# EAGLE schematic mainboard-gsm (EAGLE 6.2)
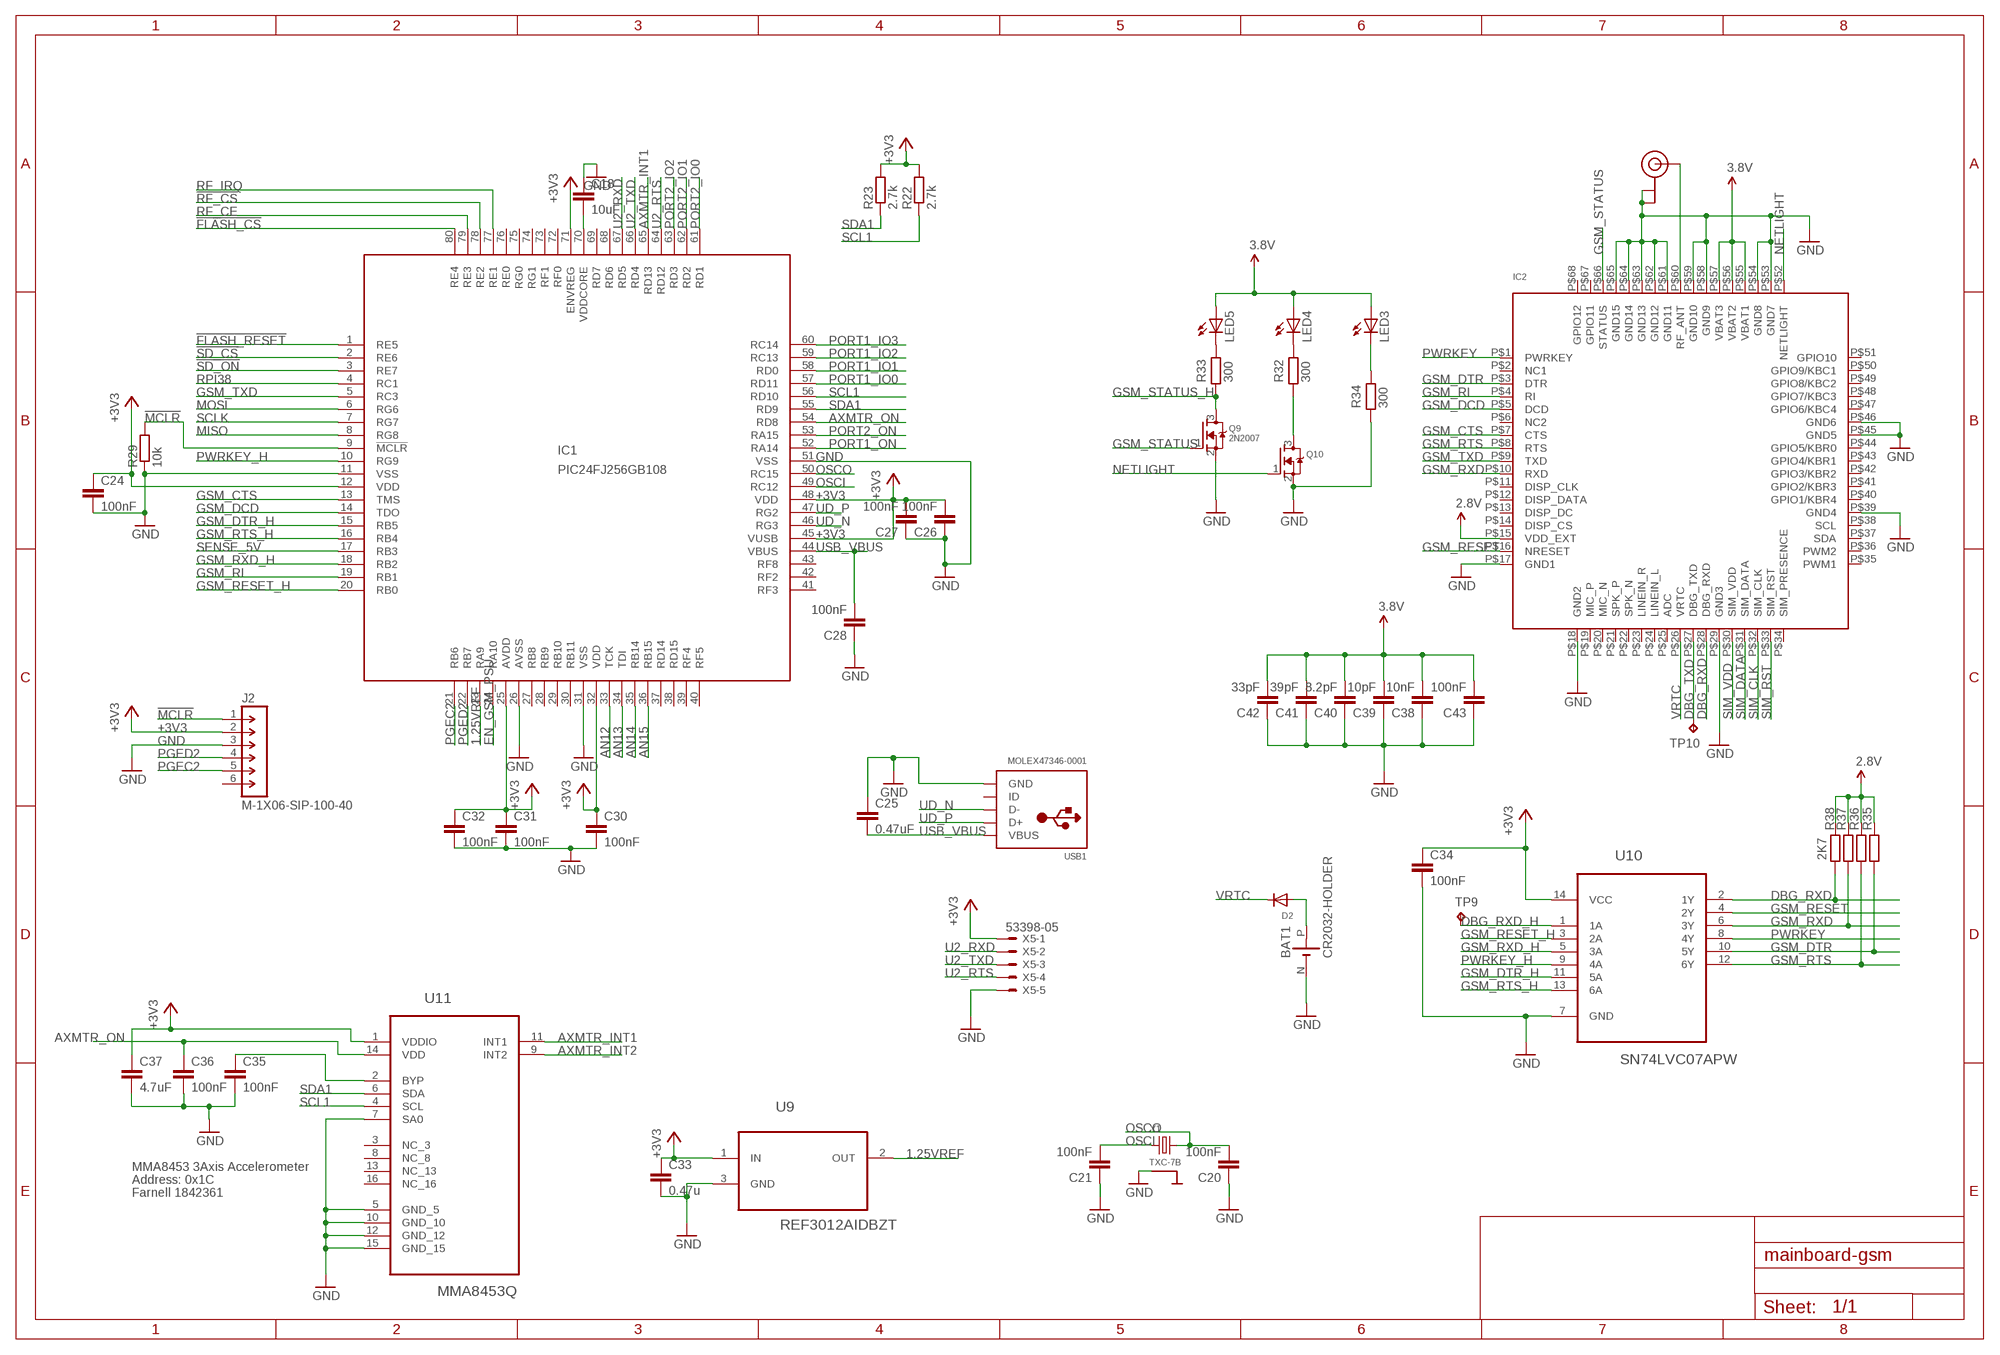
[diagram p0: schematic, sheet 1, part 1 of 3]
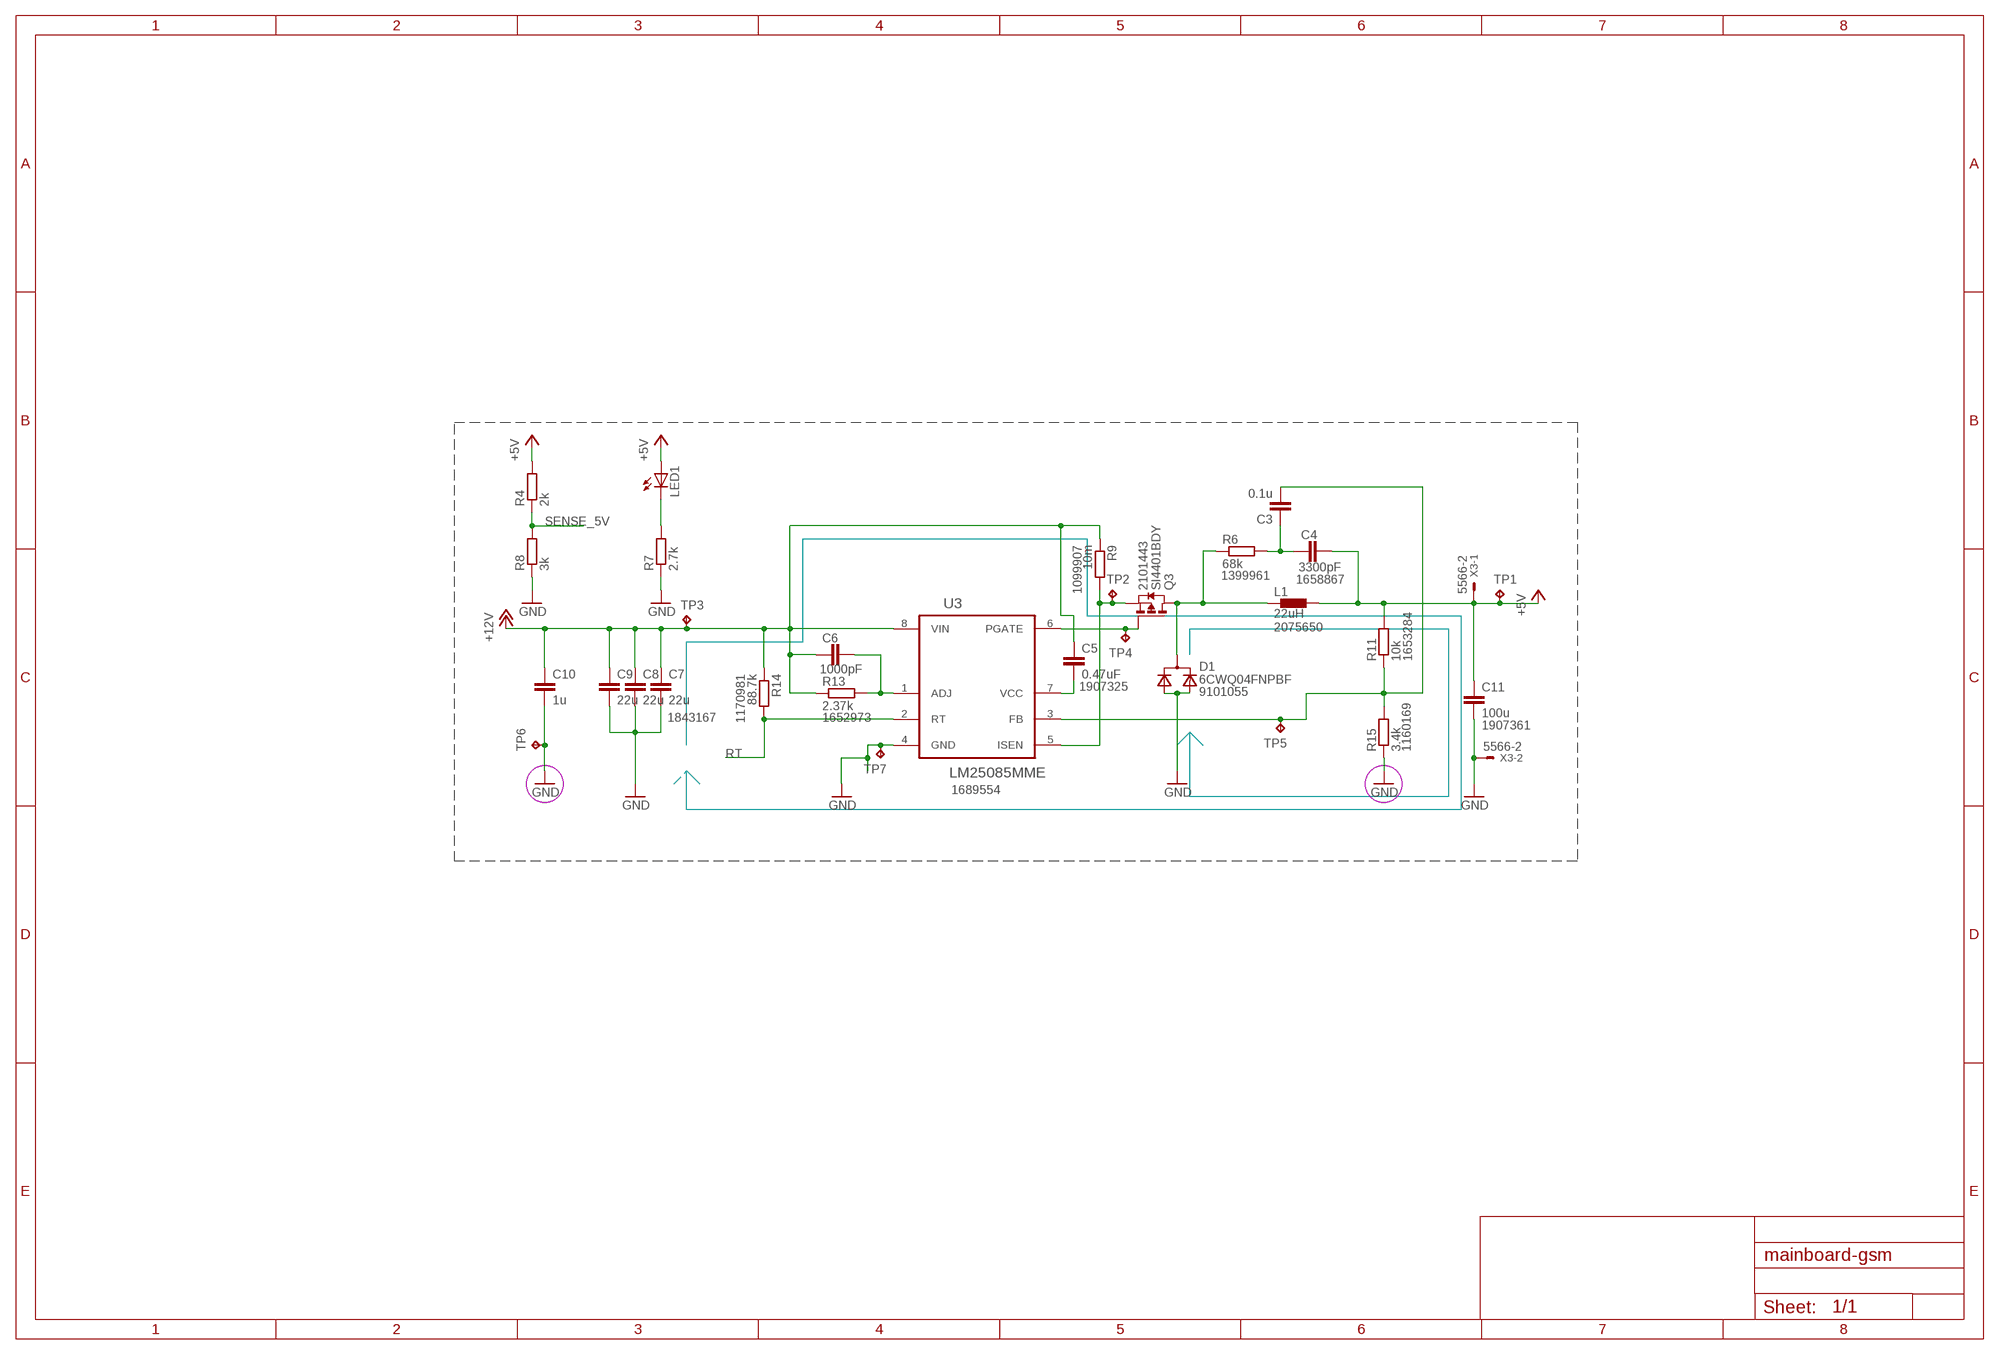
[diagram p1: schematic, sheet 1, part 2 of 3]
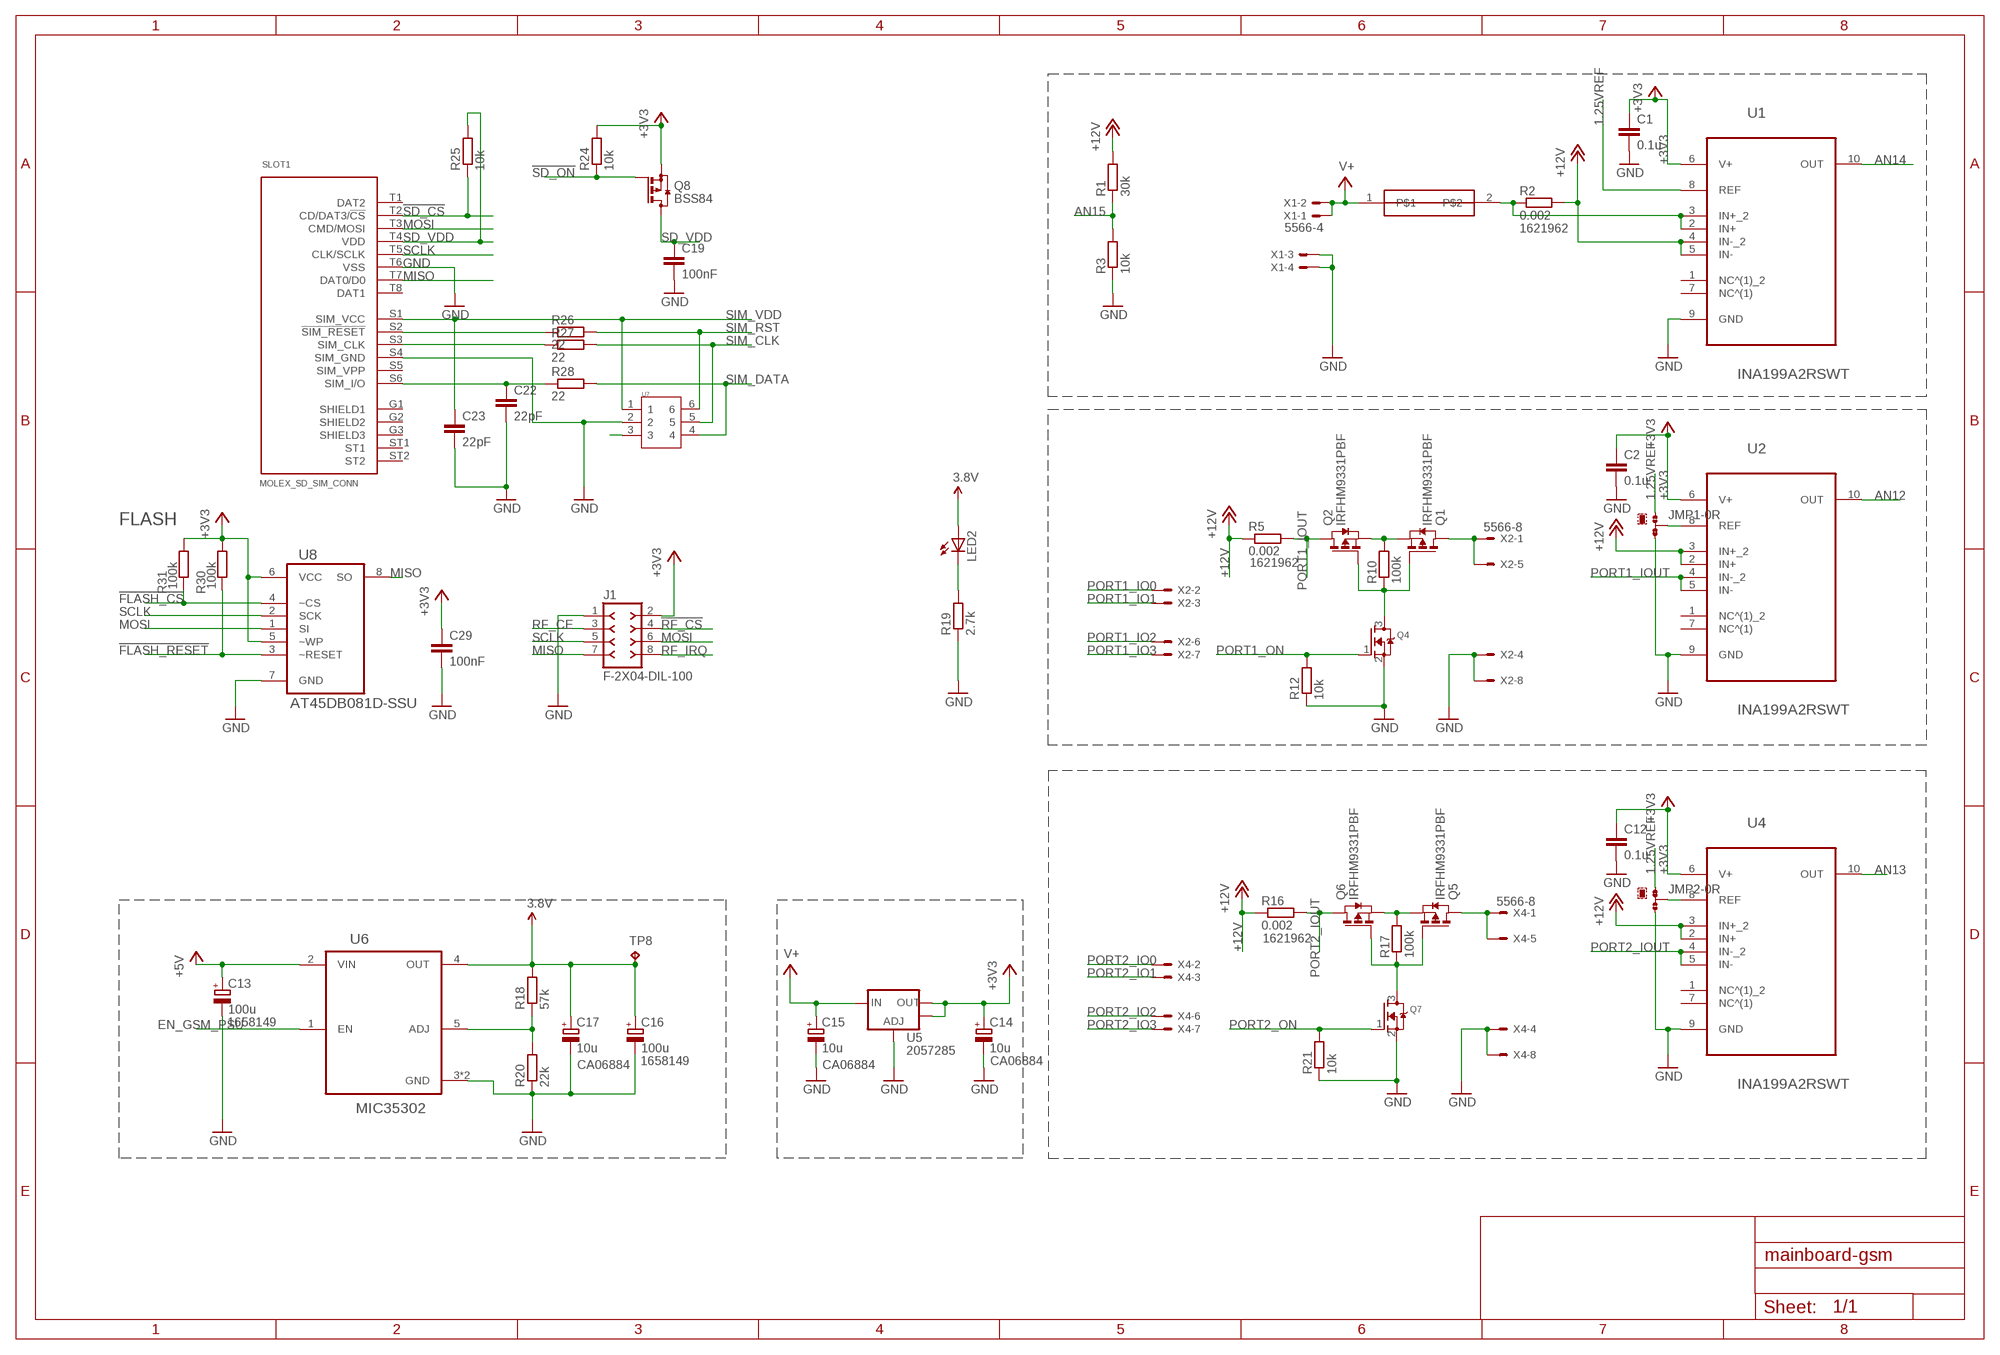
[diagram p2: schematic, sheet 1, part 3 of 3]

## Parts
ANT1  U.FL  [U.FL]
BAT1  CR2032-HOLDER  [CH28-2032L]
C1  0.1u  C-EUC0603  [C0603]
C2  0.1u  C-EUC0603  [C0603]
C3  0.1u  C-EUC0603  [C0603]
C4  3300pF  C-EUC0603  [C0603]
C5  0.47uF  C-EUC0805  [C0805]
C6  1000pF  C-EUC0603  [C0603]
C7  22u  C-EUC1812  [C1812]
C8  22u  C-EUC1812  [C1812]
C9  22u  C-EUC1812  [C1812]
C10  1u  C-EUC0805  [C0805]
C11  100u  C-EUC1210  [C1210]
C12  0.1u  C-EUC0603  [C0603]
C13  100u  CPOL-EUB/3528-21R  [B/3528-21R]
C14  10u  CPOL-EUD/7343-31R  [D/7343-31R]
C15  10u  CPOL-EUD/7343-31R  [D/7343-31R]
C16  100u  CPOL-EUB/3528-21R  [B/3528-21R]
C17  10u  CPOL-EUD/7343-31R  [D/7343-31R]
C18  10uF  C-EUC0805  [C0805]
C19  100nF  C-EUC0603  [C0603]
C20  100nF  C-EUC0603  [C0603]
C21  100nF  C-EUC0603  [C0603]
C22  22pF  C-EUC0603  [C0603]
C23  22pF  C-EUC0603  [C0603]
C24  100nF  C-EUC0603  [C0603]
C25  0.47uF  C-EUC1206  [C1206]
C26  100nF  C-EUC0603  [C0603]
C27  100nF  C-EUC0603  [C0603]
C28  100nF  C-EUC0603  [C0603]
C29  100nF  C-EUC0603  [C0603]
C30  100nF  C-EUC0603  [C0603]
C31  100nF  C-EUC0603  [C0603]
C32  100nF  C-EUC0603  [C0603]
C33  0.47u  C-EUC0805  [C0805]
C34  100nF  C-EUC0603  [C0603]
C35  100nF  C-EUC0603  [C0603]
C36  100nF  C-EUC0603  [C0603]
C37  4.7uF  C-EUC0805  [C0805]
C38  10nF  C-EUC0603  [C0603]
C39  10pF  C-EUC0603  [C0603]
C40  8.2pF  C-EUC0603  [C0603]
C41  39pF  C-EUC0603  [C0603]
C42  33pF  C-EUC0603  [C0603]
C43  100nF  C-EUC0603  [C0603]
CONN1  MINIBLADE_SOCKET  [LTF153008]
D1  6CWQ04FNPBF  [TO252-AA]
D2  DIODESOD-123  [SOD-123]
IC1  PIC24FJ256GB108  [TQFP80-12X12]
IC2  SIM900_LITERAL  [SIM900_SMT]
J1  F-2X04-DIL-100  [DIL-100-2X04]
J2  M-1X06-SIP-100-40  [SIP-100-06-40]
JMP1  0R-JUMPA  [A0R-JMP]
JMP2  0R-JUMPA  [A0R-JMP]
L1  22uH  HC9-XXX-R  [HC9-XXX-R]
LED1  LEDCHIPLED_0805  [CHIPLED_0805]
LED2  LEDCHIPLED_0805  [CHIPLED_0805]
LED3  LEDCHIPLED_0805  [CHIPLED_0805]
LED4  LEDCHIPLED_0805  [CHIPLED_0805]
LED5  LEDCHIPLED_0805  [CHIPLED_0805]
Q1  IRFHM9331PBF  [IR_PQFN_FET]
Q2  IRFHM9331PBF  [IR_PQFN_FET]
Q3  SI4401BDY  [SO8-FET]
Q4  MOSFET-NREFLOW  [SOT23]
Q5  IRFHM9331PBF  [IR_PQFN_FET]
Q6  IRFHM9331PBF  [IR_PQFN_FET]
Q7  MOSFET-NREFLOW  [SOT23]
Q8  BSS84  [SOT23]
Q9  2N2007  MOSFET-NREFLOW  [SOT23]
Q10  MOSFET-NREFLOW  [SOT23]
R1  30k  R-EU_R0805  [R0805]
R2  0.002  R-EU_R1206  [R1206]
R3  10k  R-EU_R0805  [R0805]
R4  2k  R-EU_R0805  [R0805]
R5  0.002  R-EU_R1206  [R1206]
R6  68k  R-EU_R0603  [R0603]
R7  2.7k  R-EU_R0805  [R0805]
R8  3k  R-EU_R0805  [R0805]
R9  10m  R-EU_R1206  [R1206]
R10  100k  R-EU_R0603  [R0603]
R11  10k  R-EU_R0805  [R0805]
R12  10k  R-EU_R0603  [R0603]
R13  2.37k  R-EU_R0805  [R0805]
R14  88.7k  R-EU_R0603  [R0603]
R15  3.4k  R-EU_R0805  [R0805]
R16  0.002  R-EU_R1206  [R1206]
R17  100k  R-EU_R0603  [R0603]
R18  57k  R-EU_R0603  [R0603]
R19  2.7k  R-EU_R0805  [R0805]
R20  22k  R-EU_R0603  [R0603]
R21  10k  R-EU_R0603  [R0603]
R22  2.7k  R-EU_R0603  [R0603]
R23  2.7k  R-EU_R0603  [R0603]
R24  10k  R-EU_R0603  [R0603]
R25  10k  R-EU_R0603  [R0603]
R26  22  R-EU_R0603  [R0603]
R27  22  R-EU_R0603  [R0603]
R28  22  R-EU_R0603  [R0603]
R29  10k  R-EU_R0603  [R0603]
R30  100k  R-EU_R0603  [R0603]
R31  100k  R-EU_R0603  [R0603]
R32  300  R-EU_R0603  [R0603]
R33  300  R-EU_R0603  [R0603]
R34  300  R-EU_R0603  [R0603]
R35  2K7  R-EU_R0603  [R0603]
R36  2K7  R-EU_R0603  [R0603]
R37  2K7  R-EU_R0603  [R0603]
R38  2K7  R-EU_R0603  [R0603]
SLOT1  MOLEX_SD_SIM_CONN  [MOLEX_SDSIM_COMBO]
TP1  TPTP09R  [TP09R]
TP2  TPTP10R  [TP10R]
TP3  TPTP10R  [TP10R]
TP4  TPTP10R  [TP10R]
TP5  TPTP10R  [TP10R]
TP6  TPTP10R  [TP10R]
TP7  TPTP10R  [TP10R]
TP8  TPTP09R  [TP09R]
TP9  TPTP10R  [TP10R]
TP10  TPTP10R  [TP10R]
U1  INA199A2RSWT  [QFN40P140X180X55-10N]
U2  INA199A2RSWT  [QFN40P140X180X55-10N]
U3  LM25085MME  [MINI-SO8]
U4  INA199A2RSWT  [QFN40P140X180X55-10N]
U5  V_REG_LM1117SOT223  [SOT223]
U6  MIC35302  [TO252-5]
U7  SMF05C'-SC70'  [SC70-6L]
U8  AT45DB081D-SSU  [SOIC127P600X175-8N]
U9  REF3012AIDBZT  [SOT95P237X112-3N]
U10  SN74LVC07APW  [SOP65P640X120-14N]
U11  MMA8453Q  [QFN50P300X300X100-16N]
USB1  MOLEX47346-0001  [47346-0001]
X1  5566-4  [5566-4]
X2  5566-8  [5566-8]
X3  5566-2  [5566-2]
X4  5566-8  [5566-8]
X5  53398-05  [53398-05]
Y1  TXC-7B  [TXC-7B]

## Nets
1.25VREF: IC1.23(RA9) JMP1.1 JMP2.1 U1.8(REF) U9.2(OUT)
2.8V: IC2.P$15(VDD_EXT) R35.2 R36.2 R37.2 R38.2
3.8V: C16.+ C17.+ C38.2 C39.2 C40.2 C41.2 C42.2 C43.2 IC2.P$55(VBAT1) IC2.P$56(VBAT2) IC2.P$57(VBAT3) LED2.A LED3.A LED4.A LED5.A R18.2 TP8.TP U6.4(OUT)
!FLASH_CS!: IC1.80(RE4) R31.2 U8.4(~CS)
!FLASH_RESET!: IC1.1(RE5) R30.2 U8.3(~RESET)
!MCLR!: IC1.9(!MCLR) J2.1 R29.2
!RF_CS!: IC1.78(RE2) J1.4
!SD_CS!: IC1.2(RE6) R25.1 SLOT1.T2(CD/DAT3/!CS!)
!SD_ON!: IC1.3(RE7) Q8.1(G) R24.1
+3V3: C1.1 C2.1 C12.1 C14.+ C24.1 C26.2 C27.2 C29.1 C30.1 C31.1 C32.1 C33.1 C34.1 C37.1 IC1.12(VDD) IC1.25(AVDD) IC1.32(VDD) IC1.45(VUSB) IC1.48(VDD) IC1.71(ENVREG) J1.2 J2.2 Q8.2(S) R22.2 R23.2 R24.2 R30.1 R31.1 U1.6(V+) U2.6(V+) U4.6(V+) U5.2(OUT) U5.4(OUT) U8.5(~WP) U8.6(VCC) U9.1(IN) U10.14(VCC) U11.1(VDDIO) X5.1
+5V: C4.1 C11.1 C13.+ L1.2 LED1.A R4.2 R11.2 TP1.TP U6.2(VIN) X3.1
+12V: C5.1 C6.1 C7.1 C8.1 C9.1 C10.1 R1.2 R2.2 R5.1 R9.1 R13.1 R14.1 R16.1 TP3.TP U1.4(IN-_2) U1.5(IN-) U2.2(IN+) U2.3(IN+_2) U3.8(VIN) U4.2(IN+) U4.3(IN+_2)
AN12: IC1.33(TCK) U2.10(OUT)
AN13: IC1.34(TDI) U4.10(OUT)
AN14: IC1.35(RB14) U1.10(OUT)
AN15: IC1.36(RB15) R1.1 R3.2
AXMTR_INT1: IC1.65(RD13) U11.11(INT1)
AXMTR_INT2: U11.9(INT2)
AXMTR_ON: C36.1 IC1.54(RD8) U11.14(VDD)
DBG_RXD: IC2.P$28(DBG_RXD) R38.1 U10.2(1Y)
DBG_RXD_H: TP9.TP U10.1(1A)
DBG_TXD: IC2.P$27(DBG_TXD) TP10.TP
EN_GSM_PSU: IC1.24(RA10) U6.1(EN)
GND: ANT1.P$1(GND) ANT1.P$2(GND) BAT1.N(-) C1.2 C2.2 C7.2 C8.2 C9.2 C10.2 C11.2 C12.2 C13.- C14.- C15.- C16.- C17.- C18.1 C19.2 C20.1 C21.1 C22.2 C23.2 C24.2 C25.1 C26.1 C27.1 C28.1 C29.2 C30.2 C31.2 C32.2 C33.2 C34.2 C35.2 C36.2 C37.2 C38.1 C39.1 C40.1 C41.1 C42.1 C43.1 D1.1(A1) D1.3(A2) IC1.11(VSS) IC1.26(AVSS) IC1.31(VSS) IC1.51(VSS) IC2.P$17(GND1) IC2.P$18(GND2) IC2.P$29(GND3) IC2.P$39(GND4) IC2.P$45(GND5) IC2.P$46(GND6) IC2.P$53(GND7) IC2.P$54(GND8) IC2.P$58(GND9) IC2.P$59(GND10) IC2.P$61(GND11) IC2.P$62(GND12) IC2.P$63(GND13) IC2.P$64(GND14) IC2.P$65(GND15) J1.1 J2.3 JMP1.3 JMP2.3 Q4.2(S) Q7.2(S) Q9.2(S) Q10.2(S) R3.1 R7.1 R8.1 R12.1 R15.1 R19.1 R20.1 R21.1 R29.1 R34.1 SLOT1.S4(SIM_GND) SLOT1.T6(VSS) TP6.TP TP7.TP U1.9(GND) U2.9(GND) U3.4(GND) U4.9(GND) U5.1(ADJ) U6.3(GND) U6.TAB(GND) U7.2 U8.7(GND) U9.3(GND) U10.7(GND) U11.5(GND_5) U11.7(SA0) U11.10(GND_10) U11.12(GND_12) U11.15(GND_15) USB1.5(GND) X1.3 X1.4 X2.4 X2.8 X3.2 X4.4 X4.8 X5.5 Y1.2 Y1.4
GSM_CTS: IC1.13(TMS) IC2.P$7(CTS)
GSM_DCD: IC1.14(TDO) IC2.P$5(DCD)
GSM_DTR: IC2.P$3(DTR) R35.1 U10.10(5Y)
GSM_DTR_H: IC1.15(RB5) U10.11(5A)
GSM_RESET: IC2.P$16(NRESET) U10.4(2Y)
GSM_RESET_H: IC1.20(RB0) U10.3(2A)
GSM_RI: IC1.19(RB1) IC2.P$4(RI)
GSM_RTS: IC2.P$8(RTS) R36.1 U10.12(6Y)
GSM_RTS_H: IC1.16(RB4) U10.13(6A)
GSM_RXD: IC2.P$10(RXD) R37.1 U10.6(3Y)
GSM_RXD_H: IC1.18(RB2) U10.5(3A)
GSM_STATUS: IC2.P$66(STATUS) Q9.1(G)
GSM_STATUS_H: Q9.3(D) R33.1
GSM_TXD: IC1.5(RC3) IC2.P$9(TXD)
MISO: IC1.8(RG8) J1.7 SLOT1.T7(DAT0/D0) U8.8(SO)
MOSI: IC1.6(RG6) J1.6 SLOT1.T3(CMD/MOSI) U8.1(SI)
N$1: C35.1 U11.2(BYP)
N$2: R26.1 SLOT1.S2(!SIM_RESET!)
N$3: R27.1 SLOT1.S3(SIM_CLK)
N$4: C22.1 R28.1 SLOT1.S6(SIM_I/O)
N$5: ANT1.P$3(SIGNAL) IC2.P$60(RF_ANT)
N$6: Q10.3(D) R32.1
N$7: LED5.C R33.2
N$8: LED4.C R32.2
N$9: BAT1.P(+) D2.A
N$10: Q3.4(G) TP4.TP U3.6(PGATE)
N$11: D1.4(C) L1.1 Q3.5(D) Q3.6(D) Q3.7(D) Q3.8(D) Q3.D1(D) Q3.D2(D) Q3.D3(D) R6.1
N$12: Q5.1(S) Q5.2(S) Q5.3(S) Q5.3B(S) Q6.1(S) Q6.2(S) Q6.3(S) Q6.3B(S) R17.2
N$13: C5.2 U3.7(VCC)
N$14: Q3.1(S) Q3.2(S) Q3.3(S) R9.2 TP2.TP U3.5(ISEN)
N$15: Q5.4(G) Q6.4(G) Q7.3(D) R17.1
N$16: C6.2 R13.2 U3.1(ADJ)
N$17: JMP1.2 U2.8(REF)
N$18: Q5.5(D) Q5.6(D) Q5.7(D) Q5.8(D) Q5.9(D) X4.1 X4.5
N$19: Q1.1(S) Q1.2(S) Q1.3(S) Q1.3B(S) Q2.1(S) Q2.2(S) Q2.3(S) Q2.3B(S) R10.2
N$20: Q1.4(G) Q2.4(G) Q4.3(D) R10.1
N$21: C3.1 C4.2 R6.2
N$22: C3.2 R11.1 R15.2 TP5.TP U3.3(FB)
N$23: LED3.C R34.2
N$24: Q1.5(D) Q1.6(D) Q1.7(D) Q1.8(D) Q1.9(D) X2.1 X2.5
N$25: R18.1 R20.2 U6.5(ADJ)
N$26: CONN1.2 R2.1 U1.2(IN+) U1.3(IN+_2)
N$27: JMP2.2 U4.8(REF)
N$29: U7.3
N$31: LED1.C R7.2
N$32: LED2.C R19.2
N$38: C18.2 IC1.70(VDDCORE)
NETLIGHT: IC2.P$52(NETLIGHT) Q10.1(G)
OSCI: C21.2 IC1.49(RC12) Y1.1
OSCO: C20.2 IC1.50(RC15) Y1.3
PGEC2: IC1.21(RB6) J2.5
PGED2: IC1.22(RB7) J2.4
PORT1_IO0: IC1.57(RD11) X2.2
PORT1_IO1: IC1.58(RD0) X2.3
PORT1_IO2: IC1.59(RC13) X2.6
PORT1_IO3: IC1.60(RC14) X2.7
PORT1_IOUT: Q2.5(D) Q2.6(D) Q2.7(D) Q2.8(D) Q2.9(D) R5.2 U2.4(IN-_2) U2.5(IN-)
PORT1_ON: IC1.52(RA14) Q4.1(G) R12.2
PORT2_IO0: IC1.61(RD1) X4.2
PORT2_IO1: IC1.62(RD2) X4.3
PORT2_IO2: IC1.63(RD3) X4.6
PORT2_IO3: X4.7
PORT2_IOUT: Q6.5(D) Q6.6(D) Q6.7(D) Q6.8(D) Q6.9(D) R16.2 U4.4(IN-_2) U4.5(IN-)
PORT2_ON: IC1.53(RA15) Q7.1(G) R21.2
PWRKEY: IC2.P$1(PWRKEY) U10.8(4Y)
PWRKEY_H: IC1.10(RG9) U10.9(4A)
RF_CE: IC1.79(RE3) J1.3
RF_IRQ: IC1.77(RE1) J1.8
RPI38: IC1.4(RC1)
RT: R14.2 U3.2(RT)
SCL1: IC1.56(RD10) R22.1 U11.4(SCL)
SCLK: IC1.7(RG7) J1.5 SLOT1.T5(CLK/SCLK) U8.2(SCK)
SD_VDD: C19.1 Q8.3(D) R25.2 SLOT1.T4(VDD)
SDA1: IC1.55(RD9) R23.1 U11.6(SDA)
SENSE_5V: IC1.17(RB3) R4.1 R8.2
SIM_CLK: IC2.P$32(SIM_CLK) R27.2 U7.5
SIM_DATA: IC2.P$31(SIM_DATA) R28.2 U7.4
SIM_RST: IC2.P$33(SIM_RST) R26.2 U7.6
SIM_VDD: C23.1 IC2.P$30(SIM_VDD) SLOT1.S1(SIM_VCC) U7.1
U2_RTS: IC1.64(RD12) X5.4
U2_RXD: IC1.67(RD5) X5.2
U2_TXD: IC1.66(RD4) X5.3
UD_N: IC1.46(RG3) USB1.2(D-)
UD_P: IC1.47(RG2) USB1.3(D+)
USB_VBUS: C25.2 C28.2 IC1.44(VBUS) USB1.1(VBUS)
V+: C15.+ CONN1.1 U5.3(IN) X1.1 X1.2
VRTC: D2.C IC2.P$26(VRTC)
Unconnected: IC1.27(RB8) IC1.28(RB9) IC1.29(RB10) IC1.30(RB11) IC1.37(RD14) IC1.38(RD15) IC1.39(RF4) IC1.40(RF5) IC1.41(RF3) IC1.42(RF2) IC1.43(RF8) IC1.68(RD6) IC1.69(RD7) IC1.72(RF0) IC1.73(RF1) IC1.74(RG1) IC1.75(RG0) IC1.76(RE0) IC2.P$2(NC1) IC2.P$6(NC2) IC2.P$11(DISP_CLK) IC2.P$12(DISP_DATA) IC2.P$13(DISP_DC) IC2.P$14(DISP_CS) IC2.P$19(MIC_P) IC2.P$20(MIC_N) IC2.P$21(SPK_P) IC2.P$22(SPK_N) IC2.P$23(LINEIN_R) IC2.P$24(LINEIN_L) IC2.P$25(ADC) IC2.P$34(SIM_PRESENCE) IC2.P$35(PWM1) IC2.P$36(PWM2) IC2.P$37(SDA) IC2.P$38(SCL) IC2.P$40(GPIO1/KBR4) IC2.P$41(GPIO2/KBR3) IC2.P$42(GPIO3/KBR2) IC2.P$43(GPIO4/KBR1) IC2.P$44(GPIO5/KBR0) IC2.P$47(GPIO6/KBC4) IC2.P$48(GPIO7/KBC3) IC2.P$49(GPIO8/KBC2) IC2.P$50(GPIO9/KBC1) IC2.P$51(GPIO10) J2.6 SLOT1.G1(SHIELD1) SLOT1.G2(SHIELD2) SLOT1.G3(SHIELD3) SLOT1.S5(SIM_VPP) SLOT1.ST1 SLOT1.ST2 SLOT1.T1(DAT2) SLOT1.T8(DAT1) U1.1(NC^(1)_2) U1.7(NC^(1)) U2.1(NC^(1)_2) U2.7(NC^(1)) U4.1(NC^(1)_2) U4.7(NC^(1)) U11.3(NC_3) U11.8(NC_8) U11.13(NC_13) U11.16(NC_16) USB1.4(ID)

## Notes on the sheet
- FLASH
- MMA8453 3Axis Accelerometer
- Address: 0x1C
- Farnell 1842361

## Power pins joined to a net without a drawn wire
GPIO11: IC2.P$67(GPIO11)
GPIO12: IC2.P$68(GPIO12)

## Library data of the parts
ANT1 = SparkFun-Connectors:U.FL: SMD antenna connector- WRL-09144
BAT1 = probox-parts:CR2032-HOLDER: http://onecall.farnell.com/multicomp/ch28-2032lf/battery-holder-smt-20mm/dp/2064725?ref=lookahead
C1-C3 C6 C8-C10 C12 C18-C43 = resistor:C-EU: CAPACITOR, European symbol
C4 = resistor:C-EU: CAPACITOR, European symbol; FARNELL: 1658867
C5 = resistor:C-EU: CAPACITOR, European symbol; FARNELL: 1907325
C7 = resistor:C-EU: CAPACITOR, European symbol; FARNELL: 1843167
C11 = resistor:C-EU: CAPACITOR, European symbol; FARNELL: 1907361
C13 C16 = resistor:CPOL-EU: POLARIZED CAPACITOR, European symbol; FARNELL: 1658149
C14 C15 C17 = resistor:CPOL-EU: POLARIZED CAPACITOR, European symbol; FARNELL: CA06884
CONN1 = eko-parts:MINIBLADE_SOCKET
D1 = probox-parts:6CWQ04FNPBF; FARNELL: 9101055
D2 = adafruit:DIODE: Diode SMADIODE - SMA Surface Mount Package 20V 1A Schottky Diode Digikey: 641-1014-6-ND DO-1N4148 - Through Hole Small Current Diode SOD-123 20V 1 A (.5mV Vf) Schottky Diode - Digikey: MBRX120TPMSCT-ND SOD-323 10V 570mA (.38mV Vf, 3ns) Schottky Diode - Digikey: ZLLS410CT-ND SOD-523 30V 30mA Schottky Diode (RB751S-40TE61) - Digikey: RB751S-40TE61CT-ND SOT23-R/W - SOT23 Package (R = Solder Paste/Reflow Ovens, W = Hand-Soldering) BAT54Film 40V 300mA - Digikey: 497-7162-1-ND
IC1 = microchip:PIC24FJ256GB108: PIC24FJ256GB108 edit this description Auto generated by make-symbol-device-package-bsdl.ulp Rev. 25 Source: PIC24FJ256GB108.bsd; MPN: PIC24FJ256GB108-I/PT; OC_FARNELL: 1576869; OC_NEWARK: 54M5131
IC2 = microbuilder:SIM900_LITERAL: SIM900 Quad-Band GSM/GPRS Module Power Supply: 3.2-4.8V Temperature Range: -30°C-+80°C Bands: GSM 850, EGSM 900, DCS 1800, PCS 1900
J1 = con-headers-jp:F-2X04-: FEMALE HEADER
J2 = con-headers-jp:M-1X06-: MALE HEADER
JMP1 JMP2 = jump-0r-smd:0R-JUMP: SMD 0R 0805 Jumper
L1 = probox-parts:HC9-XXX-R; FARNELL: 2075650
LED1-LED5 = led:LED: LED OSRAM: - CHIPLED LG R971, LG N971, LY N971, LG Q971, LY Q971, LO R971, LY R971 LH N974, LH R974 LS Q976, LO Q976, LY Q976 LO Q996 - Hyper CHIPLED LW Q18S LB Q993, LB Q99A, LB R99A - SideLED LS A670, LO A670, LY A670, LG A670, LP A670 LB A673, LV A673, LT A673, LW A673 LH A674 LY A675 LS A676, LA A676, LO A676, LY A676, LW A676 LS A679, LY A679, LG A679 - Hyper Micro SIDELED® LS Y876, LA Y876, LO Y876, LY Y876 LT Y87S - SmartLED LW L88C, LW L88S LB L89C, LB L89S, LG L890 LS L89K, LO L89K, LY L89K LS L896, LA L896, LO L896, LY L896 - TOPLED LS T670, LO T670, LY T670, LG T670, LP T670 LSG T670, LSP T670, LSY T670, LOP T670, LYG T670 LG T671, LOG T671, LSG T671 LB T673, LV T673, LT T673, LW T673 LH T674 LS T676, LA T676, LO T676, LY T676, LB T676, LH T676, LSB T676, LW T676 LB T67C, LV T67C, LT T67C, LS T67K, LO T67K, LY T67K, LW E67C LS E67B, LA E67B, LO E67B, LY E67B, LB E67C, LV E67C, LT E67C LW T67C LS T679, LY T679, LG T679 LS T770, LO T770, LY T770, LG T770, LP T770 LB T773, LV T773, LT T773, LW T773 LH T774 LS E675, LA E675, LY E675, LS T675 LS T776, LA T776, LO T776, LY T776, LB T776 LHGB T686 LT T68C, LB T68C - Hyper Mini TOPLED® LB M676 - Mini TOPLED Santana® LG M470 LS M47K, LO M47K, LY M47K Source: http://www.osram.convergy.de LUXEON: - LUMILED® LXK2-PW12-R00, LXK2-PW12-S00, LXK2-PW14-U00, LXK2-PW14-V00 LXK2-PM12-R00, LXK2-PM12-S00, LXK2-PM14-U00 LXK2-PE12-Q00, LXK2-PE12-R00, LXK2-PE12-S00, LXK2-PE14-T00, LXK2-PE14-U00 LXK2-PB12-K00, LXK2-PB12-L00, LXK2-PB12-M00, LXK2-PB14-N00, LXK2-PB14-P00, LXK2-PB14-Q00 LXK2-PR12-L00, LXK2-PR12-M00, LXK2-PR14-Q00, LXK2-PR14-R00 LXK2-PD12-Q00, LXK2-PD12-R00, LXK2-PD12-S00 LXK2-PH12-R00, LXK2-PH12-S00 LXK2-PL12-P00, LXK2-PL12-Q00, LXK2-PL12-R00 Source: www.luxeon.com KINGBRIGHT: KA-3528ASYC Source: www.kingbright.com
Q1 Q2 Q5 Q6 = probox-parts:IRFHM9331PBF
Q3 = probox-parts:SI4401BDY; FARNELL: 2101443
Q4 Q7 Q9 Q10 = adafruit:MOSFET-N: N-Channel Mosfet 2N7002E - 60V 260mA SOT23 [Digikey: 2N7002ET1GOSTR-ND] - REEL BSH103 - 30V 850mA SOT23 [Digikey: 568-5013-1-ND]
Q8 = transistor-small-signal:BSS84: P-CHANNEL MOS FET; FARNELL: 1972673
R1 R3 R4 R7 R8 R10 R12 R17-R38 = resistor:R-EU_: RESISTOR, European symbol
R2 R5 R16 = resistor:R-EU_: RESISTOR, European symbol; FARNELL: 1621962
R6 = resistor:R-EU_: RESISTOR, European symbol; FARNELL: 1399961
R9 = resistor:R-EU_: RESISTOR, European symbol; FARNELL: 1099907
R11 = resistor:R-EU_: RESISTOR, European symbol; FARNELL: 1653284
R13 = resistor:R-EU_: RESISTOR, European symbol; FARNELL: 1652973
R14 = resistor:R-EU_: RESISTOR, European symbol; FARNELL: 1170981
R15 = resistor:R-EU_: RESISTOR, European symbol; FARNELL: 1160169
SLOT1 = farnellparts:MOLEX_SD_SIM_CONN; FARNELL: 2064064; MOLEX: 49448-1411
TP1-TP10 = testpad:TP: Test pad
U1 U2 U4 = probox-parts:INA199A2RSWT: Voltage Output, High or Low Side Measurement, Bi-Directional Zerø-Drift Series CURRENT SHUNT MONITOR; MPN: INA199A2RSWT; OC_FARNELL: 1815789; OC_NEWARK: 74R0562; PACKAGE: UQFN-10; SUPPLIER: Texas Instrument
U3 = probox-parts:LM25085; FARNELL: 1689554
U5 = SparkFun-PowerIC:V_REG_LM1117: Voltage Regulator LM1117 Standard adjustable voltage regulator but in SMD form. Spark Fun Electronics SKU : COM-00595; FARNELL: 2057285
U6 = probox-parts:MIC35302; FARNELL: 1822373
U7 = IC:SMF05C: http://www.semtech.com/images/datasheet/smf05c.pdf
U8 = farnellparts:AT45DB081D-SSU; DESCRIPTION: Data Flash; MPN: AT45DB081D-SSU; OC_FARNELL: 1455038; OC_NEWARK: 58M3836; PACKAGE: SOIC-8; SUPPLIER: Atmel
U9 = probox-parts:REF3012AIDBZT: CMOS VOLTAGE REFERENCE; MPN: REF3120AIDBZT; OC_FARNELL: 1470321; OC_NEWARK: 90H3371; PACKAGE: SOT-23-3; SUPPLIER: Texas Instruments
U10 = farnellparts:SN74LVC07APW; DESCRIPTION: QUADRUPLE FET BUS SWITCH 2.5-V/3.3-V LOW-VOLTAGE BUS SWITCH WITH 5-V-TOLERANT LEVEL SHIFTER; MPN: SN74LVC07APW; OC_FARNELL: 1236302; OC_NEWARK: 13M5252; PACKAGE: TSSOP-14; SUPPLIER: Texas Instruments
U11 = farnellparts:MMA8453Q
USB1 = connectors-bbng:MOLEX47346-0001: USB Micro B http://onecall.farnell.com/jsp/search/browse.jsp;jsessionid=IUXOLF3HYHDEGCQLCIPJOXQ?N=411&Ntk=gensearch&Ntt=47346-0001&Ntx=mode+matchallpartial&exposeLevel2Refinement=true&suggestions=false&ref=globalsearch&_requestid=528981
X1 = con-molex:5566-4: Mini FIT connector 4 pol Source: http://www.molex.com; OC_FARNELL: unknown; OC_NEWARK: unknown
X2 X4 = con-molex:5566-8: Mini FIT connector 8 pol Source: http://www.molex.com; OC_FARNELL: unknown; OC_NEWARK: unknown
X3 = con-molex:5566-2: Mini FIT connector 2 pol Source: http://www.molex.com; OC_FARNELL: 1822072; OC_NEWARK: unknown
X5 = con-molex:53?-05: CONNECTOR wire to board 1.25 mm (.049 inch) pitch header; OC_FARNELL: 1125354; OC_NEWARK: unknown
Y1 = minibox-parts:TXC-7B